# EAGLE design AMFS PCB4 (EAGLE 9.6.2)
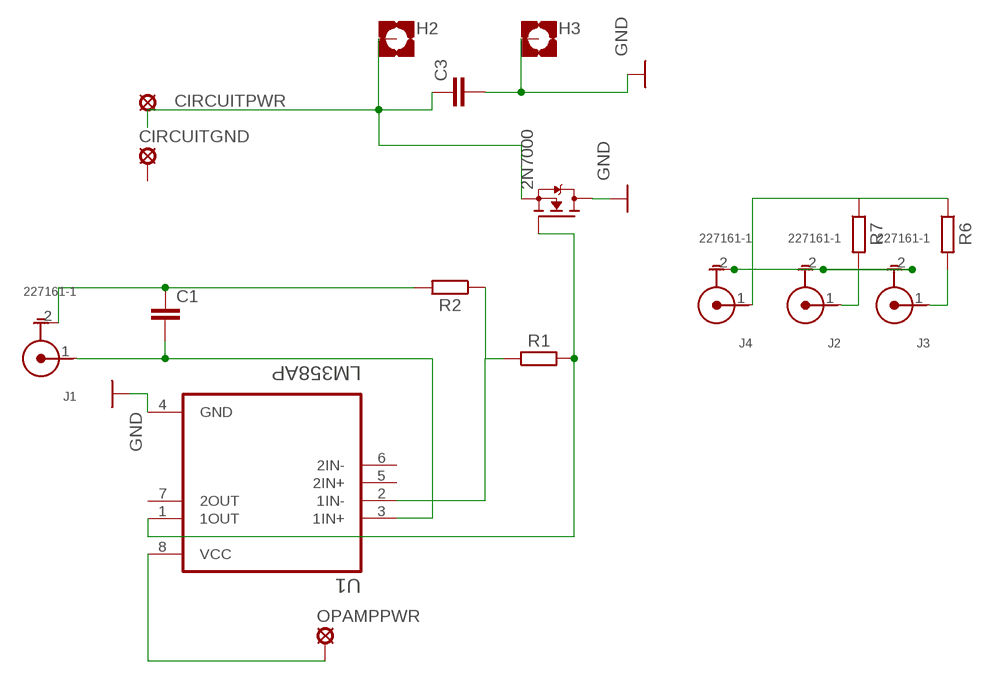
[diagram p0: schematic, sheet 1]

## Parts
C1  C5/3.5  [C5B3.5]
C3  C5/3.5  [C5B3.5]
CIRCUITGND  LSP10  [LSP10]
CIRCUITPWR  MCS10B  [MCS10B]
H2  MOUNT-PAD-SQUARE2.8  [2,8-PAD-SQUARE]
H3  MOUNT-PAD-SQUARE2.8  [2,8-PAD-SQUARE]
J1  227161-1  [TE_227161-1]
J2  227161-1  [TE_227161-1]
J3  227161-1  [TE_227161-1]
J4  227161-1  [TE_227161-1]
OPAMPPWR  LSP10  [LSP10]
R1  R_AXIAL-7.2MM-PITCH  [RESAD724W46L381D178B]
R2  R_AXIAL-7.2MM-PITCH  [RESAD724W46L381D178B]
R6  R_AXIAL-7.2MM-PITCH  [RESAD724W46L381D178B]
R7  R_AXIAL-7.2MM-PITCH  [RESAD724W46L381D178B]
SHUNT  2N7000  [TO92-]
U1  LM358AP  [DIP794W45P254L959H508Q8]

## Nets
GND: C3.2 H3.B2,8(MOUNT) SHUNT.1(D) U1.4(GND)
N$1: C3.1 CIRCUITPWR.MP H2.B2,8(MOUNT) SHUNT.3(S)
N$2: OPAMPPWR.MP U1.8(VCC)
N$3: C1.2 J1.1(C) U1.3(1IN+)
N$4: C1.1 J1.2(G) R2.2
N$5: R1.1 R2.1 U1.2(1IN-)
N$6: J2.1(C) R7.2
N$7: R1.2 SHUNT.2(G) U1.1(1OUT)
N$8: J3.1(C) R6.2
N$9: J2.2(G) J3.2(G) J4.2(G)
N$10: J4.1(C) R6.1 R7.1
Unconnected: CIRCUITGND.MP U1.5(2IN+) U1.6(2IN-) U1.7(2OUT)

## Library data of the parts
C1 C3 = capacitor-wima:C: CAPACITOR naming: grid - package width
CIRCUITGND OPAMPPWR = solpad:LSP10: SOLDER PAD drill 1.0 mm, distributor Buerklin, 12H555
CIRCUITPWR = solpad:MCS10B: SOLDER PAD MC S1, distributor Buerklin, 15F505
H2 H3 = holes:MOUNT-PAD-SQUARE: MOUNTING PAD, square
J1-J4 = 227161-1:227161-1: CONN BNC JACK R/A 50 OHM PCB Check availability <https://pricing.snapeda.com/parts/227161-1/TE%20Connectivity/view-part?ref=eda>; AVAILABILITY: In Stock; COMMENT: 227161-1; DESCRIPTION: BNC Series 50 Ohm Right Angle Through Hole Jack Female Socket Connector; MF: TE Connectivity; MP: 227161-1; PACKAGE: None; PRICE: None; PURCHASE-URL: https://pricing.snapeda.com/search/part/227161-1/?ref=eda
R1 R2 R6 R7 = Resistor:R: Resistor Fixed - Generic; CATEGORY: Resistor; SUB-CATEGORY: Fixed
SHUNT = 2N7000:2N7000: Check availability <https://pricing.snapeda.com/parts/2N7000/STMicroelectronics/view-part?ref=eda>; AVAILABILITY: In Stock; DESCRIPTION: N-Channel 60 V 350mA (Tc) 1W (Tc) Through Hole TO-92-3; MF: STMicroelectronics; MP: 2N7000; PACKAGE: E-PKG AXIAL-LEADED-2 ON Semiconductor; PRICE: None; PURCHASE-URL: https://pricing.snapeda.com/search/part/2N7000/?ref=eda
U1 = LM358AP:LM358AP: Check availability <https://pricing.snapeda.com/parts/LM358AP/Texas%20Instruments/view-part?ref=eda>; AVAILABILITY: In Stock; DESCRIPTION: Dual, 30-V, 700-kHz, 3-mV offset voltage operational amplifier; MF: Texas Instruments; MP: LM358AP; PACKAGE: PDIP-8 Texas; PRICE: None; PURCHASE-URL: https://pricing.snapeda.com/search/part/LM358AP/?ref=eda

## Net classes
0 default: width 0.305 mm, drill 0.813 mm, clearance 0.254 mm

## Board
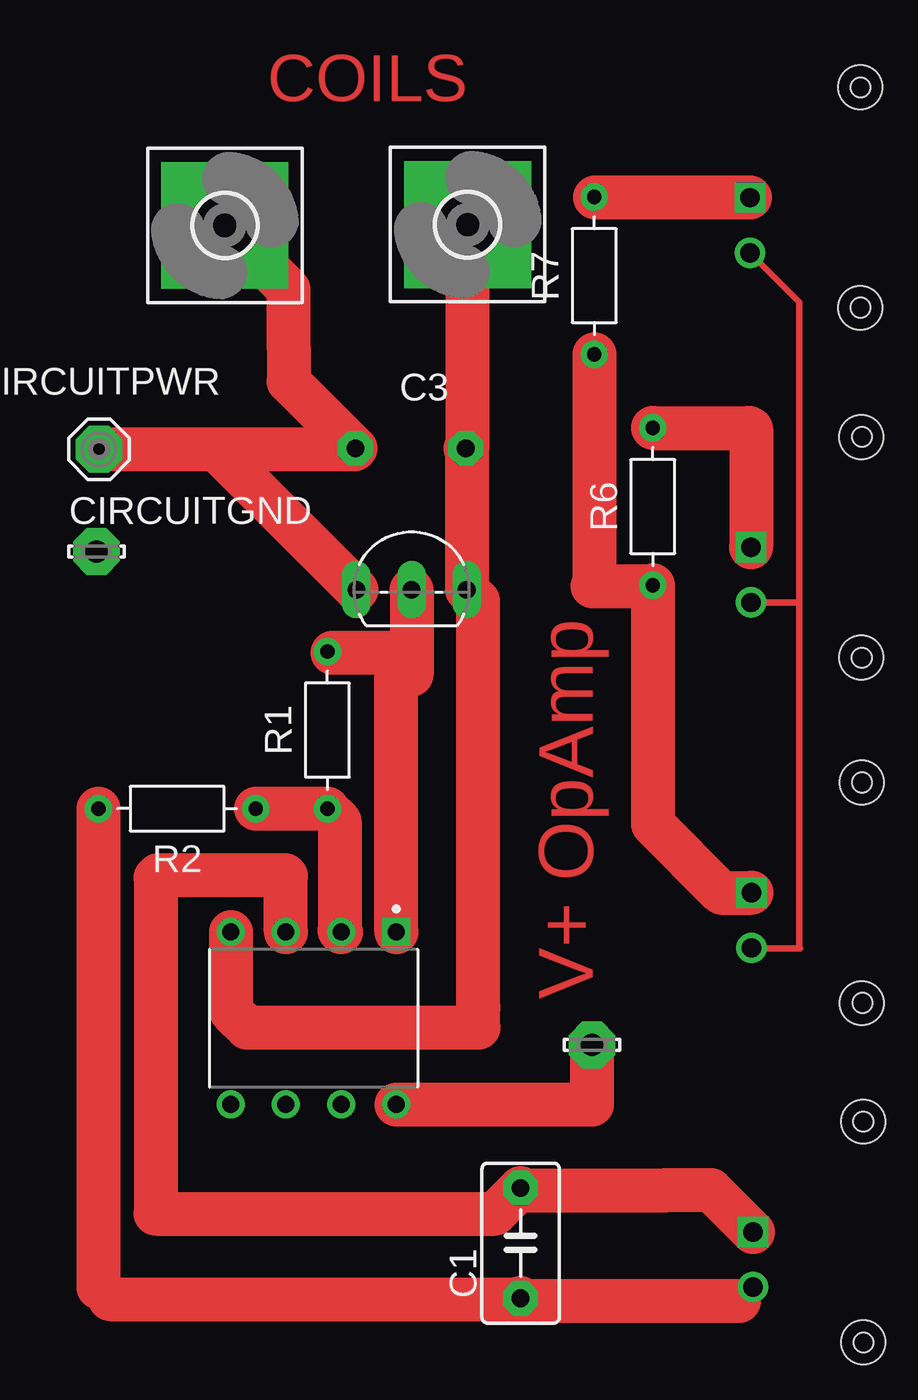
[diagram p1: board, top side]
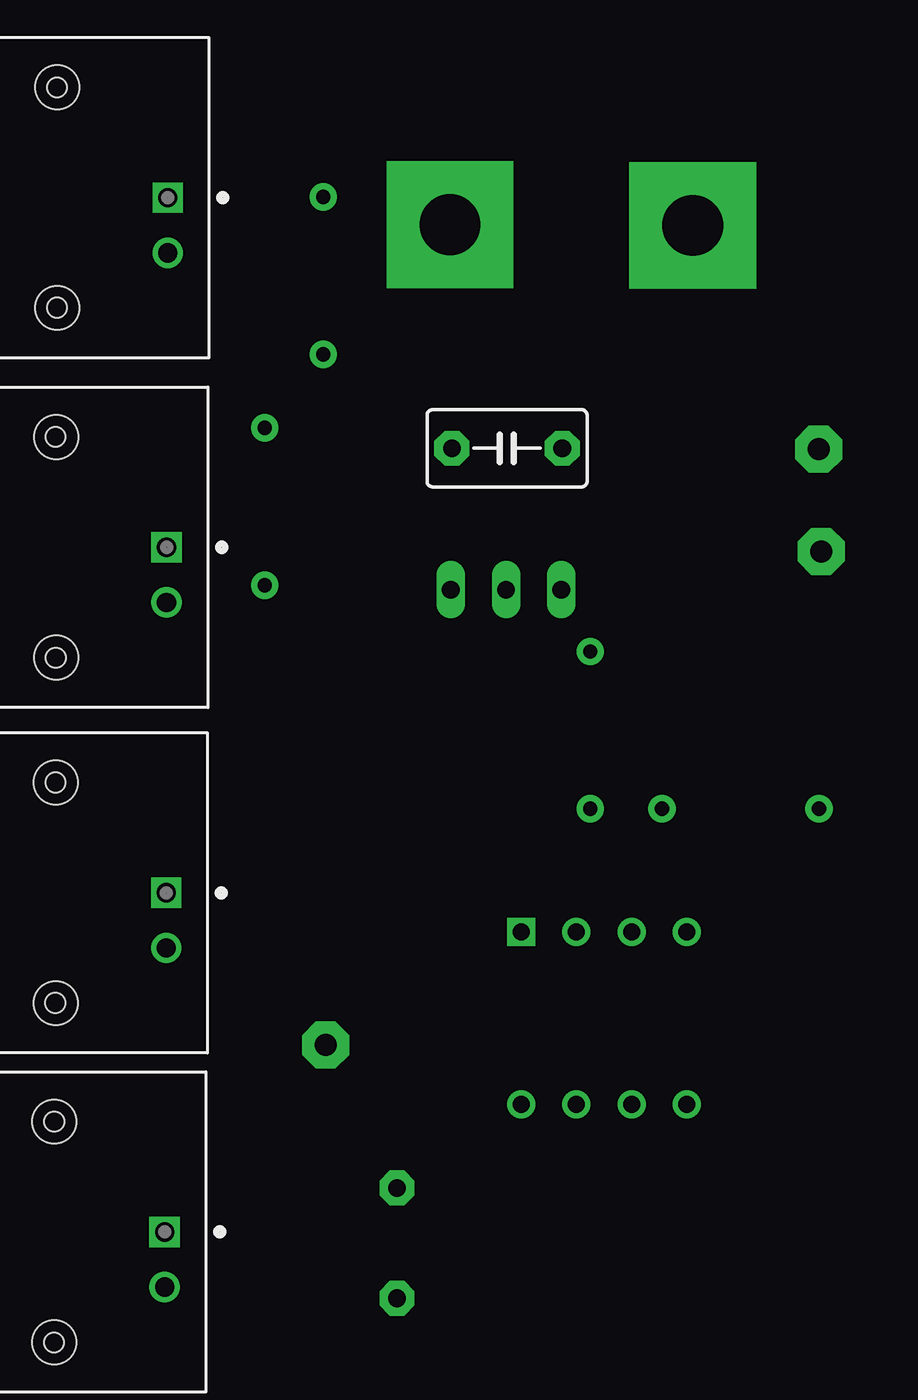
[diagram p2: board, bottom side, seen from below]

No outline drawn. Coordinates in mm, seen from the top.
Copper layers (1*16): Top 0.035mm / dielectric 1.5mm / Bottom 0.035mm
Design rules "default": minimum track width 6mil, minimum drill 0.35mm, track to track 6mil, track to pad 6mil, pad to pad 6mil, via to via 6mil, smd to smd 6mil, copper to edge 40mil, drill to drill 6mil, minimum pad ring 10mil, minimum via ring 8mil, stop-mask expansion 4mil, vias tented up to drill 0mil, thermal gap 10mil
Holes 0.9 mm at 37.66,2.59 37.65,12.76 37.52,60.38 37.52,50.24 37.59,44.29 37.58,34.12 37.59,28.38 37.61,18.23

### Footprints (pad centres in the part's own frame; a part is rotated, then mirrored left to right if it is on the bottom)
C5B3.5 = drill 0.813 pad 1.6 octagon: 1 -2.54,0; 2 2.54,0
LSP10 = drill 1.016 pad 2.159 octagon: MP 0,0
MCS10B = drill 1.016 pad 2.159 octagon: MP 0,0
2,8-PAD-SQUARE = drill 2.8 pad 5.842 square: B2,8 0,0
TE_227161-1 = drill 0.89 square: 1 0,0 | drill 0.89: 2 -2.54,0 | hole 2.01: -5.08,5.08; 5.08,5.08
RESAD724W46L381D178B = drill 0.66 pad 1.26: 1 -3.62,0; 2 3.62,0
TO92- = drill 0.813 long: 1 2.54,0; 2 0,0; 3 -2.54,0
DIP794W45P254L959H508Q8 = drill 0.78 pad 1.13 square: 1 -3.97,3.81 | drill 0.78 pad 1.13: 2 -3.97,1.27; 3 -3.97,-1.27; 4 -3.97,-3.81; 5 3.97,-3.81; 6 3.97,-1.27; 7 3.97,1.27; 8 3.97,3.81

### Placement (x,y rotation side)
C1  21.87,7.16 90 top
C3  16.81,43.76 180 bottom
CIRCUITGND  2.35,39.01 0 top
CIRCUITPWR  2.47,43.72 180 top
H2  8.26,54.02 0 top
H3  19.43,54.06 0 top
J1  32.57,7.68 90 bottom
J2  32.43,55.3 90 bottom
J3  32.48,39.2 90 bottom
J4  32.5,23.29 90 bottom
OPAMPPWR  25.16,16.29 180 top
R1  12.98,30.79 90 top
R2  6.06,27.17 180 top
R6  27.96,41.08 90 top
R7  25.27,51.71 90 top
SHUNT  16.86,37.25 0 top
U1  12.34,17.52 270 top

### Tracks (layer width: path | path; a pad name or v marks a point on that pad's centre or on a via)
GND
  Top 0.305: SHUNT.1 | 8.53,17.84 8.59,17.79 | C3.2 19.39,43.71 | 19.93,18 19.91,18.01
  Top 2.032: U1.4 8.53,17.84 | 19.39,43.71 SHUNT.1 19.91,36.73 19.91,18.01 | C3.2 19.43,43.85 H3.B2,8 | 8.59,17.79 9.28,17.09 19.93,17.09 19.93,18
N$1
  Top 0.305: 14.22,43.72 C3.1 | 11.2,48.46 11.21,48.47 | CIRCUITPWR.MP 7.85,43.72
  Top 2.032: CIRCUITPWR.MP 14.22,43.72 | C3.1 11.2,46.83 11.2,48.46 11.2,51.09 H2.B2,8 | SHUNT.3 7.85,43.72
N$2
  Top 2.032: U1.8 25.16,13.55 OPAMPPWR.MP
N$3
  Top 0.305: 11.07,24.06 11.02,24.11 | 5.19,24.11 5.08,23.99
  Top 2.032: U1.3 11.07,24.06 | 11.02,24.11 5.19,24.11 | 5.08,23.99 5.08,8.52 20.69,8.52 C1.2 22,9.57 28.5,9.57 28.54,9.61 30.63,9.61 J1.1
N$4
  Top 0.305: 2.44,5.11 2.97,4.58 | 21.83,4.58 C1.1 | 31.92,4.49 J1.2
  Top 2.032: R2.2 2.44,5.11 | 2.97,4.58 21.83,4.58 | 31.92,4.49 22,4.49 C1.1
N$5
  Top 0.305: R2.1
  Top 2.032: U1.2 13.55,21.55 13.55,26.6 R1.1 R2.1
N$6
  Top 0.305: 25.29,55.3 R7.2
  Top 2.032: J2.1 25.29,55.3
N$7
  Top 0.305: R1.2 13.14,34.41 13.21,34.34 | 16.15,34.34 16.15,33.28 16.81,33.28 16.86,33.33
  Top 2.032: U1.1 16.15,33.28 | 16.15,34.34 13.21,34.34 | SHUNT.2 16.86,33.33
N$8
  Top 0.305: 32.4,44.7 32.42,44.72 32.48,44.66
  Top 2.032: R6.2 32.4,44.7 | 32.48,44.66 J3.1
N$9
  Top 0.305: J2.2 34.7,50.49 34.7,36.7 | 34.7,36.7 34.67,36.66 J3.2 | 34.7,36.7 34.7,20.78 34.75,20.73 32.52,20.73 J4.2
N$10
  Top 0.305: 25.27,37.49 25.18,37.41 | 27.91,37.41 R6.1
  Top 2.032: R7.1 25.27,37.49 | 25.18,37.41 27.91,37.41 | R6.1 27.96,26.45 31.12,23.29 J4.1

### Text on the board
Top: COILS | V+ OpAmp